# EAGLE design Stethi_v2 (EAGLE 7.4.0)
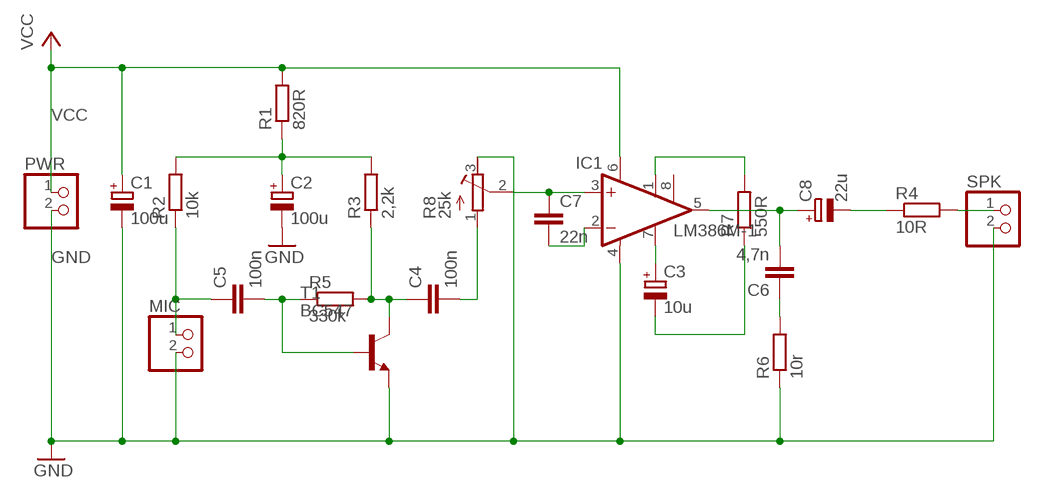
[diagram p0: schematic, sheet 1]

## Parts
C1  100u  CPOL-EUD/7343-31R  [D/7343-31R]
C2  100u  CPOL-EUD/7343-31R  [D/7343-31R]
C3  10u  CPOL-EUA/3216-18R  [A/3216-18R]
C4  100n  C-EUC0805K  [C0805K]
C5  100n  C-EUC0805K  [C0805K]
C6  4,7n  C-EUC0805K  [C0805K]
C7  22n  C-EUC0805K  [C0805K]
C8  22u  CPOL-EUA/3216-18R  [A/3216-18R]
IC1  LM386M-1  [SO08]
MIC  PINHD-1X2  [1X02]
PWR  PINHD-1X2  [1X02]
R1  820R  R-EU_R0805  [R0805]
R2  10k  R-EU_R0805  [R0805]
R3  2,2k  R-EU_R0805  [R0805]
R4  10R  R-EU_R0805  [R0805]
R5  330k  R-EU_R0805  [R0805]
R6  10r  R-EU_R0805  [R0805]
R7  550R  R-EU_R0805  [R0805]
R8  25k  R-TRIMM5X  [RTRIM5X]
SPK  PINHD-1X2  [1X02]
T1  BC547  BC847  [SOT23]

## Nets
GND: C1.- C2.- IC1.4(GND) MIC.2 PWR.2 R6.1 R8.3(E) SPK.2 T1.2(E)
N$1: C2.+ R1.1 R2.2 R3.2
N$2: C5.1 MIC.1 R2.1
N$3: C7.2 IC1.2(-IN)
N$4: C7.1 IC1.3(+IN) R8.2(S)
N$5: C5.2 R5.1 T1.1(B)
N$6: C4.2 R8.1(A)
N$7: C4.1 R3.1 R5.2 T1.3(C)
N$8: C6.1 R6.2
N$9: C3.+ IC1.7(BYPASS)
N$10: R4.2 SPK.1
N$11: C6.2 C8.+ IC1.5(OUT)
N$12: C8.- R4.1
N$13: IC1.1(GAIN) R7.2
N$14: C3.- R7.1
VCC: C1.+ IC1.6(VS) PWR.1 R1.2
Unconnected: IC1.8(GAIN)

## Library data of the parts
C1-C3 C8 = resistor:CPOL-EU: POLARIZED CAPACITOR, European symbol
C4-C7 = resistor:C-EU: CAPACITOR, European symbol
IC1 = linear:LM386?-*: Low Voltage Audio Power Amplifier Source: http://cache.national.com/ds/LM/LM386.pdf
MIC PWR SPK = pinhead:PINHD-1X2: PIN HEADER
R1-R7 = resistor:R-EU_: RESISTOR, European symbol
R8 = rcl:R-TRIMM: Trimm resistor
T1 = transistor-neu-to92:BC847: NPN TRANSISTOR

## Board
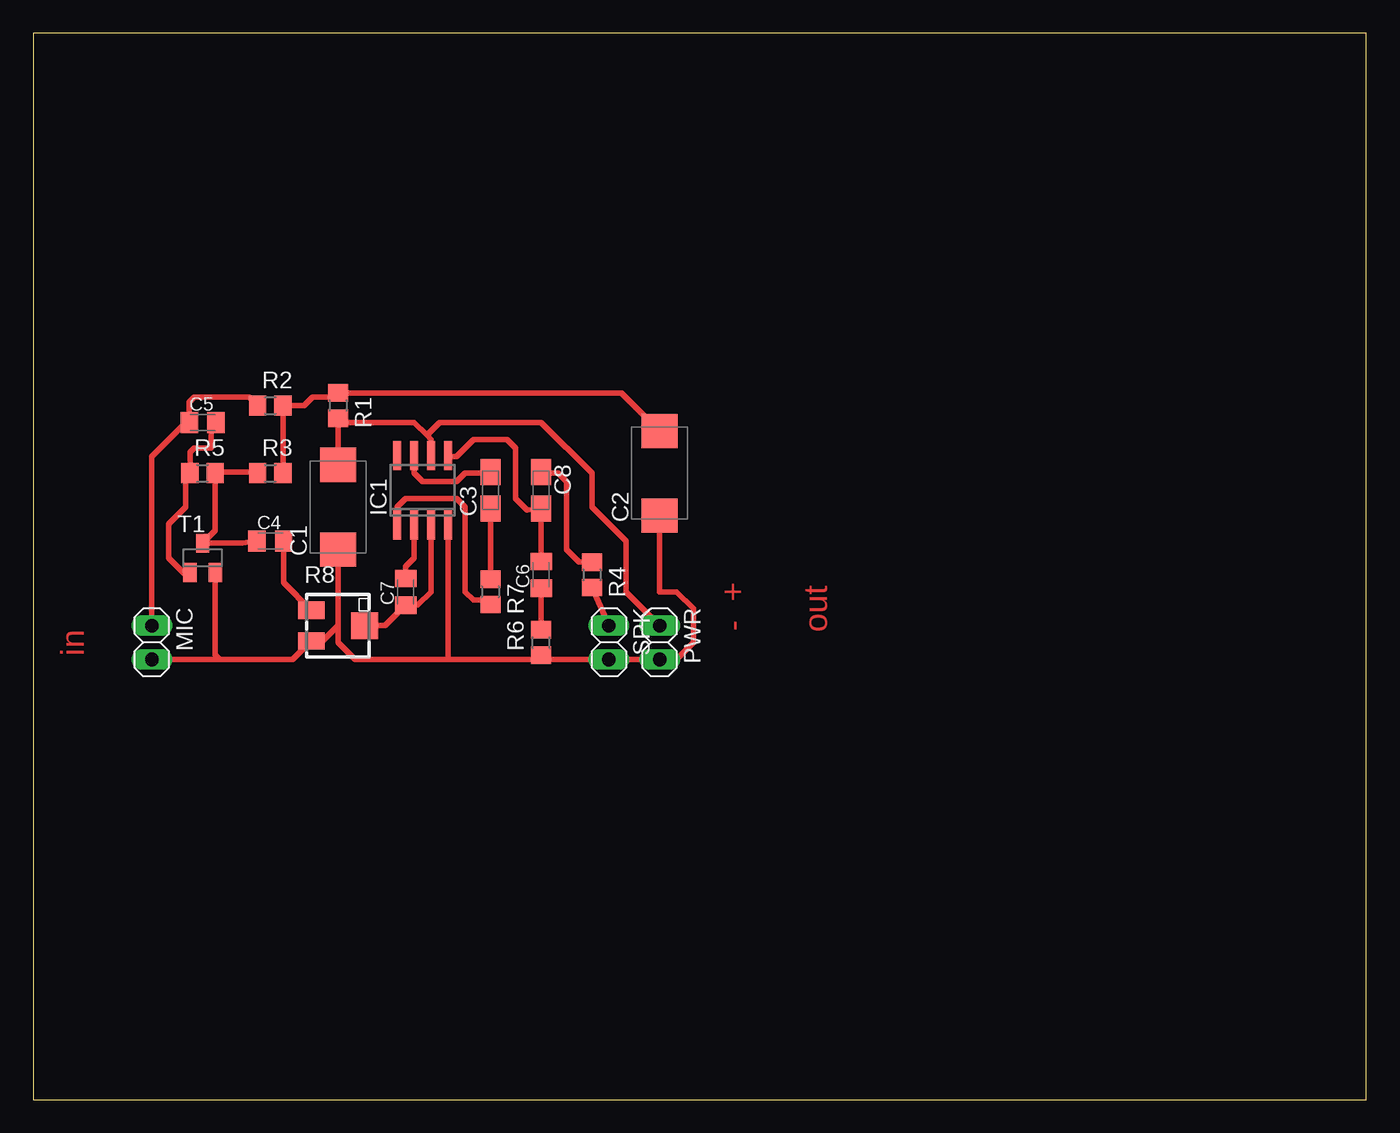
[diagram p1: board, top side]

Size 100 x 80 mm. Coordinates in mm from the lower left corner, seen from the top.
Outline: 0,0 100,0 100,80 0,80 0,0
Copper layers (1*16): Top 0.035mm / dielectric 1.5mm / Bottom 0.035mm
Design rules "default *": minimum track width 0.4mm, minimum drill 24mil, track to track 0.4mm, track to pad 0.4mm, pad to pad 0.4mm, via to via 0.4mm, smd to smd 0.4mm, copper to edge 40mil, drill to drill 8mil, minimum pad ring 10mil, minimum via ring 8mil, stop-mask expansion 4mil, vias tented up to drill 0mil, thermal gap 10mil

### Footprints (pad centres in the part's own frame; a part is rotated, then mirrored left to right if it is on the bottom)
D/7343-31R = smd 2.55 x 2.7: + 3.175,0; - -3.175,0
A/3216-18R = smd 1.95 x 1.5: + 1.375,0; - -1.375,0
C0805K = smd 1.3 x 1.6: 1 -1,0; 2 1,0
SO08 = smd 0.6 x 2.2: 1 -1.905,-2.6; 2 -0.635,-2.6; 3 0.635,-2.6; 4 1.905,-2.6; 5 1.905,2.6; 6 0.635,2.6; 7 -0.635,2.6; 8 -1.905,2.6
1X02 = drill 1.016 long: 1 -1.27,0; 2 1.27,0
R0805 = smd 1.3 x 1.5: 1 -0.95,0; 2 0.95,0
RTRIM5X = smd 1.3 x 2: 1 -1.15,-2; 3 1.15,-2 | smd 2 x 2: 2 0,2
SOT23 = smd 1 x 1.4: 1 -0.95,-1.1; 2 0.95,-1.1; 3 0,1.1

### Placement (x,y rotation side)
C1  22.86,44.45 90 top
C2  46.99,46.99 90 top
C3  34.29,45.72 90 top
C4  17.78,41.91 0 top
C5  12.7,50.8 0 top
C6  38.1,39.37 90 top
C7  27.94,38.1 90 top
C8  38.1,45.72 270 top
IC1  29.21,45.72 0 top
MIC  8.89,34.29 270 top
PWR  46.99,34.29 270 top
R1  22.86,52.07 270 top
R2  17.78,52.07 0 top
R3  17.78,46.99 0 top
R4  41.91,39.37 270 top
R5  12.7,46.99 0 top
R6  38.1,34.29 90 top
R7  34.29,38.1 270 top
R8  22.86,35.56 270 top
SPK  43.18,34.29 270 top
T1  12.7,40.64 0 top

### Tracks (layer width: path | path; a pad name or v marks a point on that pad's centre or on a via)
GND
  Top 0.406: 38.1,33.02 SPK.2 PWR.2 48.26,33.02 49.53,34.29 49.53,36.83 48.26,38.1 46.99,38.1 C2.- | MIC.2 13.97,33.02 | 13.97,33.02 19.47,33.02 R8.3 21.71,34.41 22.86,35.56 | T1.2 13.65,33.34 13.97,33.02 | C1.- 22.86,35.56 | 22.86,35.56 22.86,34.29 24.13,33.02 31.11,33.02 | 31.11,33.02 IC1.4 | R6.1 38.1,33.02 | 38.1,33.02 31.11,33.02
N$1
  Top 0.406: R3.2 R2.2 20.32,52.07 20.95,52.7 22.55,52.7 R1.1 44.13,53.02 C2.+
N$2
  Top 0.406: R2.1 16.2,52.7 12.06,52.7 11.7,52.34 C5.1 11.43,50.8 8.89,48.26 MIC.1
N$3
  Top 0.406: C7.2 27.94,40.01 28.57,40.64 IC1.2
N$4
  Top 0.406: IC1.3 29.84,38.1 28.84,37.1 C7.1 26.4,35.56 R8.2
N$5
  Top 0.406: T1.1 11.58,39.37 11.43,39.37 10.16,40.64 10.16,43.18 11.43,44.45 11.43,46.99 R5.1 11.75,48.58 12.06,48.9 13.34,48.9 13.34,50.44 C5.2
N$6
  Top 0.406: C4.2 18.78,38.79 R8.1
N$7
  Top 0.254: 13.72,47.09 R5.2
  Top 0.406: 13.72,47.09 16.69,47.09 R3.1 | R5.2 13.65,42.69 T1.3 15.68,41.74 C4.1
N$8
  Top 0.406: R6.2 C6.1
N$9
  Top 0.406: IC1.7 28.57,46.99 29.21,46.35 31.75,46.35 32.38,46.99 34.09,46.99 C3.+
N$10
  Top 0.406: SPK.1 R4.2
N$11
  Top 0.406: C6.2 C8.+ 37.03,44.24 36.2,45.09 36.2,48.9 35.56,49.53 33.02,49.53 31.75,48.26 31.18,48.26 IC1.5
N$12
  Top 0.406: R4.1 40.96,40.32 40.01,41.27 40.01,46.35 39.37,46.99 38.2,46.99 C8.-
N$13
  Top 0.406: IC1.1 27.3,44.45 27.94,45.09 31.75,45.09 32.38,44.45 32.38,38.1 33.02,37.47 33.98,37.47 R7.2
N$14
  Top 0.406: R7.1 C3.-
VCC
  Top 0.406: C1.+ R1.2 23.18,50.8 28.57,50.8 29.53,49.85 | IC1.6 29.84,49.53 29.53,49.85 | PWR.1 44.45,38.1 44.45,41.91 41.91,44.45 41.91,46.99 38.1,50.8 30.48,50.8 29.53,49.85

### Text on the board
Top: + | out | - | in